# EAGLE schematic draftBoard (EAGLE 6.6.0)
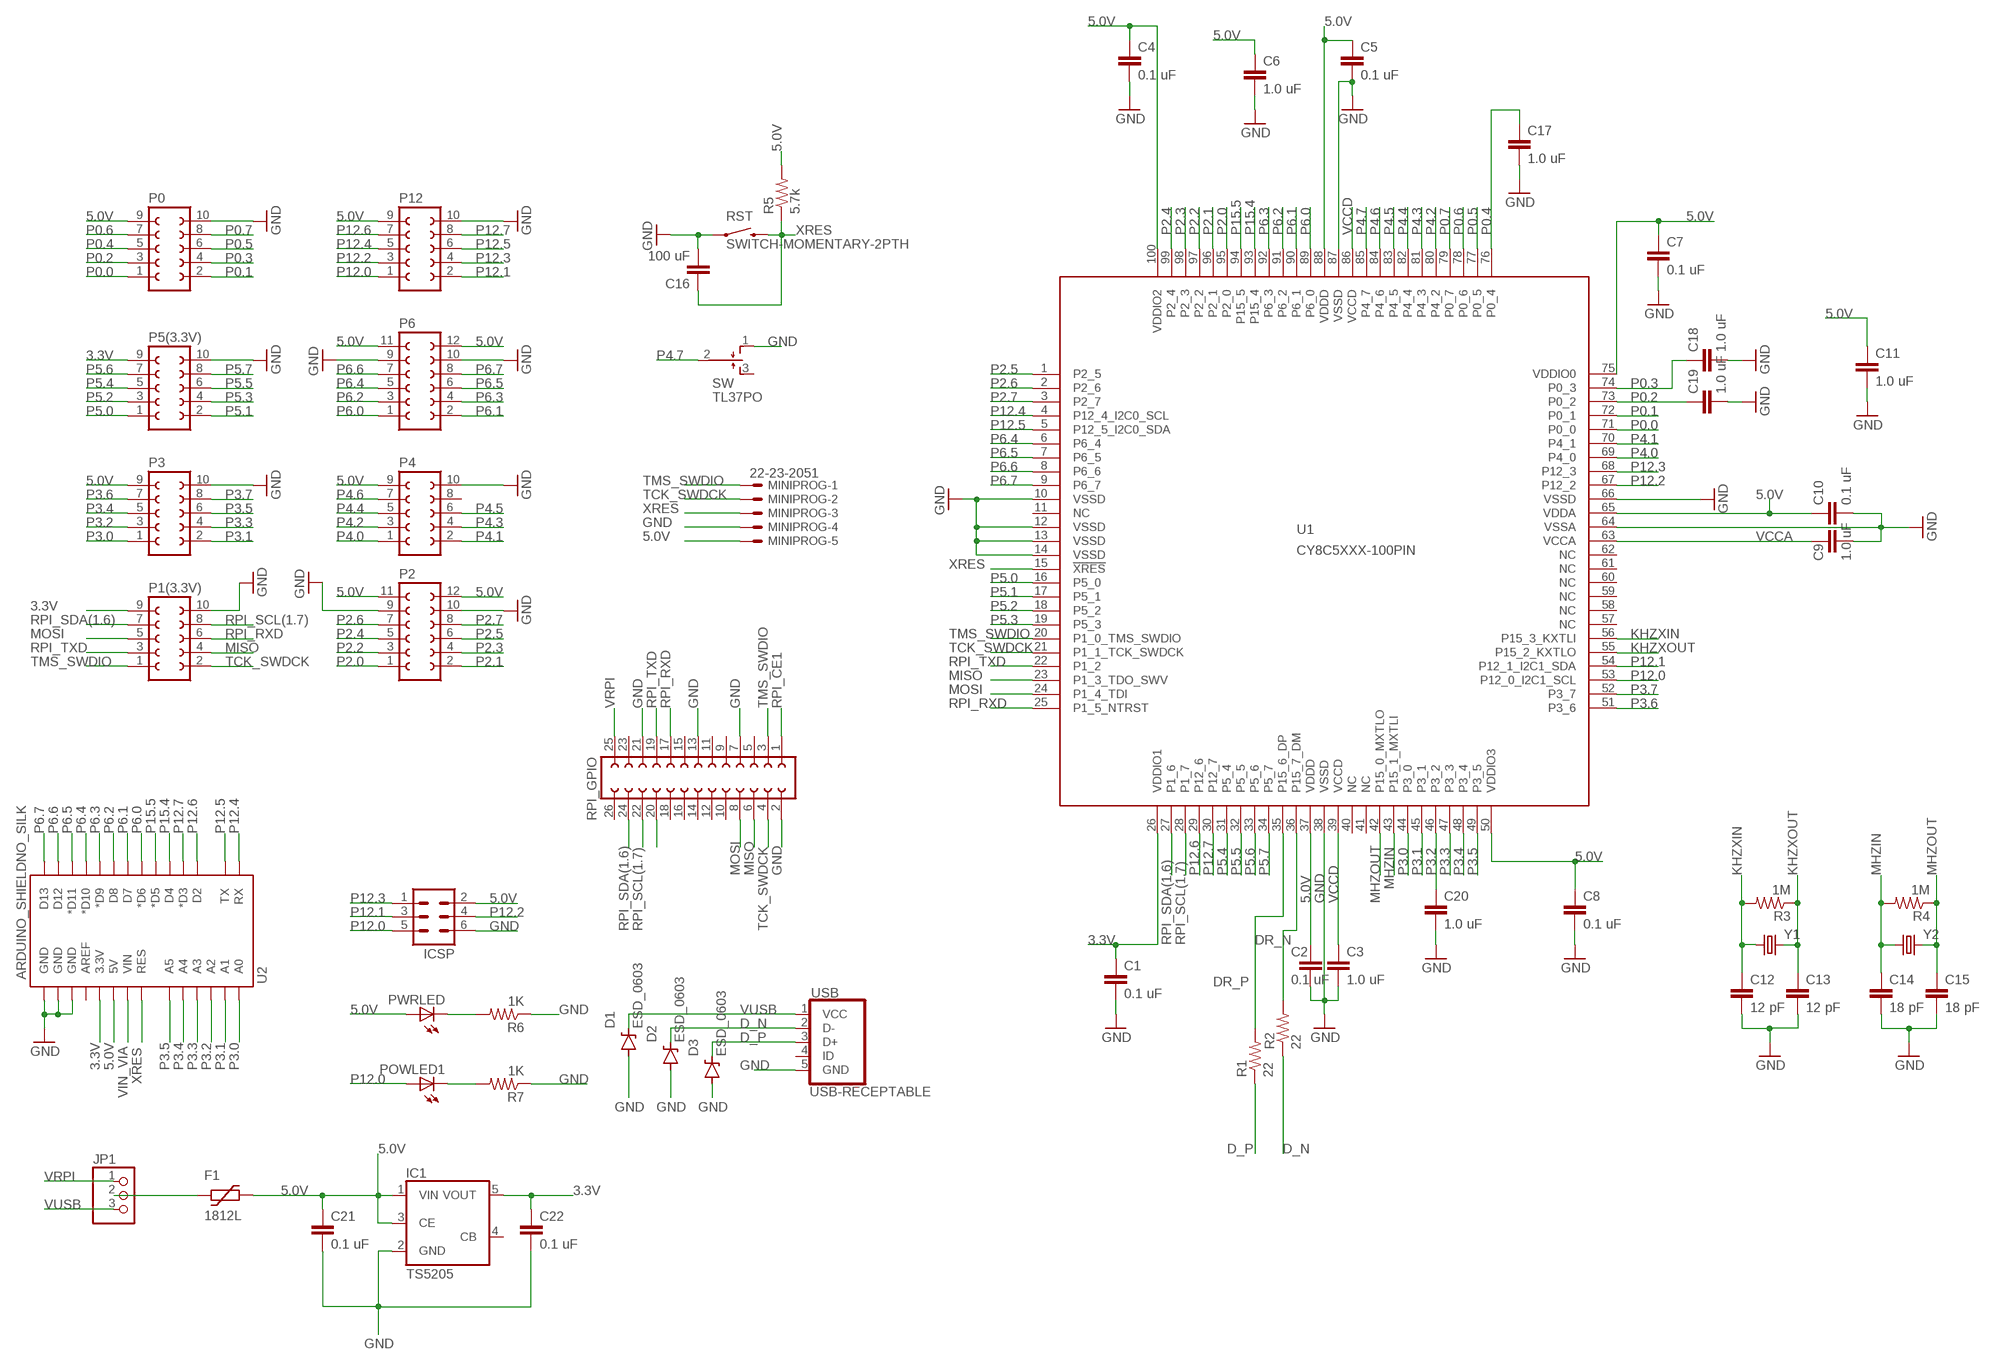
[diagram p0: schematic, sheet 1]

## Parts
C1  0.1 uF  CAP0603-CAP  [0603-CAP@1]
C2  0.1 uF  CAP0603-CAP  [0603-CAP@1]
C3  1.0 uF  CAP0603-CAP  [0603-CAP@1]
C4  0.1 uF  CAP0603-CAP  [0603-CAP@1]
C5  0.1 uF  CAP0603-CAP  [0603-CAP@1]
C6  1.0 uF  CAP0603-CAP  [0603-CAP@1]
C7  0.1 uF  CAP0603-CAP  [0603-CAP@1]
C8  0.1 uF  CAP0603-CAP  [0603-CAP@1]
C9  1.0 uF  CAP0603-CAP  [0603-CAP@1]
C10  0.1 uF  CAP0603-CAP  [0603-CAP@1]
C11  1.0 uF  CAP0603-CAP  [0603-CAP@1]
C12  12 pF  CAP0603-CAP  [0603-CAP@1]
C13  12 pF  CAP0603-CAP  [0603-CAP@1]
C14  18 pF  CAP0603-CAP  [0603-CAP@1]
C15  18 pF  CAP0603-CAP  [0603-CAP@1]
C16  100 uF  CAP0603-CAP  [0603-CAP@1]
C17  1.0 uF  CAP0603-CAP  [0603-CAP@1]
C18  1.0 uF  CAP0603-CAP  [0603-CAP@1]
C19  1.0 uF  CAP0603-CAP  [0603-CAP@1]
C20  1.0 uF  CAP0603-CAP  [0603-CAP@1]
C21  0.1 uF  CAP0603-CAP  [0603-CAP@1]
C22  0.1 uF  CAP0603-CAP  [0603-CAP@1]
D1  ESD_0603  [0603-CAP]
D2  ESD_0603  [0603-CAP]
D3  ESD_0603  [0603-CAP]
F1  1812L  [1812L]
IC1  TS5205  [SOT25]
ICSP  MA03-2  [MA03-2]
JP1  PINHD-1X3  [1X03]
MINIPROG  22-23-2051  [22-23-2051]
P0  FE05-2  [FE05-2]
P1(3.3V)  FE05-2  [FE05-2]
P2  FE06-2  [FE06-2]
P3  FE05-2  [FE05-2]
P4  FE05-2  [FE05-2]
P5(3.3V)  FE05-2  [FE05-2]
P6  FE06-2  [FE06-2]
P12  FE05-2  [FE05-2]
POWLED1  LED0603  [LED-0603]
PWRLED  LED0603  [LED-0603]
R1  22  RESISTOR0603-RES  [0603-RES]
R2  22  RESISTOR0603-RES  [0603-RES]
R3  1M  RESISTOR0603-RES  [0603-RES]
R4  1M  RESISTOR0603-RES  [0603-RES]
R5  5.7k  RESISTOR0603-RES  [0603-RES]
R6  1K  RESISTOR0603-RES  [0603-RES]
R7  1K  RESISTOR0603-RES  [0603-RES]
RPI_GPIO  FE13-2  [FE13-2]
RST  SWITCH-MOMENTARY-2PTH  [TACTILE-PTH]
SW  TL37PO  [TL3XPO]
U1  CY8C5XXX-100PIN  [TQFP-14X14-100]
U2  ARDUINO_SHIELDNO_SILK  [DUEMILANOVE_VIAS]
USB  USB-RECEPTABLE  [FCI-10103594-0001LF]
Y1  CRYSTALTC26H  [TC26H]
Y2  CRYSTALHC49US  [HC49US]

## Nets
3.3V: C1.1 C22.1 IC1.5(VOUT) P1(3.3V).9 P5(3.3V).9 U1.26(VDDIO1) U2.3.3V
5.0V: C2.1 C4.1 C5.1 C6.1 C7.1 C8.1 C10.1 C11.1 C21.1 F1.P$2 IC1.1(VIN) IC1.3(CE) ICSP.2 MINIPROG.5 P0.9 P2.11 P2.12 P3.9 P4.9 P6.11 P6.12 P12.9 PWRLED.A R5.2 U1.37(VDDD) U1.50(VDDIO3) U1.65(VDDA) U1.75(VDDIO0) U1.88(VDDD) U1.100(VDDIO2) U2.5V
D_N: D2.1(C) R2.1 USB.2(D-)
D_P: D3.1(C) R1.1 USB.3(D+)
DR_N: R2.2 U1.36(P15_7_DM)
DR_P: R1.2 U1.35(P15_6_DP)
GND: C1.2 C2.2 C3.2 C4.2 C5.2 C6.2 C7.2 C8.2 C9.2 C10.2 C11.2 C12.2 C13.2 C14.2 C15.2 C16.2 C17.2 C18.2 C19.2 C20.2 C21.2 C22.2 D1.2(A) D2.2(A) D3.2(A) IC1.2(GND) ICSP.6 MINIPROG.4 P0.10 P1(3.3V).10 P2.9 P2.10 P3.10 P4.10 P5(3.3V).10 P6.9 P6.10 P12.10 R6.1 R7.1 RPI_GPIO.2 RPI_GPIO.7 RPI_GPIO.13 RPI_GPIO.21 RST.1 SW.1(O) U1.10(VSSD) U1.12(VSSD) U1.13(VSSD) U1.14(VSSD) U1.38(VSSD) U1.64(VSSA) U1.66(VSSD) U1.87(VSSD) U2.GND@0(GND) U2.GND@1(GND) U2.GND@2(GND) USB.5(GND)
KHZXIN: C12.1 R3.2 U1.56(P15_3_KXTLI) Y1.1
KHZXOUT: C13.1 R3.1 U1.55(P15_2_KXTLO) Y1.2
MHZIN: C14.1 R4.2 U1.43(P15_1_MXTLI) Y2.1
MHZOUT: C15.1 R4.1 U1.42(P15_0_MXTLO) Y2.2
MISO: P1(3.3V).4 RPI_GPIO.6 U1.23(P1_3_TDO_SWV)
MOSI: P1(3.3V).5 RPI_GPIO.8 U1.24(P1_4_TDI)
N$2: PWRLED.C R6.2
N$3: F1.P$1 JP1.2
N$6: POWLED1.C R7.2
N$16: RPI_GPIO.20
P0.0: P0.1 U1.71(P0_0)
P0.1: P0.2 U1.72(P0_1)
P0.2: C19.1 P0.3 U1.73(P0_2)
P0.3: C18.1 P0.4 U1.74(P0_3)
P0.4: C17.1 P0.5 U1.76(P0_4)
P0.5: P0.6 U1.77(P0_5)
P0.6: P0.7 U1.78(P0_6)
P0.7: P0.8 U1.79(P0_7)
P2.0: P2.1 U1.95(P2_0)
P2.1: P2.2 U1.96(P2_1)
P2.2: P2.3 U1.97(P2_2)
P2.3: P2.4 U1.98(P2_3)
P2.4: P2.5 U1.99(P2_4)
P2.5: P2.6 U1.1(P2_5)
P2.6: P2.7 U1.2(P2_6)
P2.7: P2.8 U1.3(P2_7)
P3.0: P3.1 U1.44(P3_0) U2.A0
P3.1: P3.2 U1.45(P3_1) U2.A1
P3.2: C20.1 P3.3 U1.46(P3_2) U2.A2
P3.3: P3.4 U1.47(P3_3) U2.A3
P3.4: P3.5 U1.48(P3_4) U2.A4
P3.5: P3.6 U1.49(P3_5) U2.A5
P3.6: P3.7 U1.51(P3_6)
P3.7: P3.8 U1.52(P3_7)
P4.0: P4.1 U1.69(P4_0)
P4.1: P4.2 U1.70(P4_1)
P4.2: P4.3 U1.80(P4_2)
P4.3: P4.4 U1.81(P4_3)
P4.4: P4.5 U1.82(P4_4)
P4.5: P4.6 U1.83(P4_5)
P4.6: P4.7 U1.84(P4_6)
P4.7: SW.2(P) U1.85(P4_7)
P5.0: P5(3.3V).1 U1.16(P5_0)
P5.1: P5(3.3V).2 U1.17(P5_1)
P5.2: P5(3.3V).3 U1.18(P5_2)
P5.3: P5(3.3V).4 U1.19(P5_3)
P5.4: P5(3.3V).5 U1.31(P5_4)
P5.5: P5(3.3V).6 U1.32(P5_5)
P5.6: P5(3.3V).7 U1.33(P5_6)
P5.7: P5(3.3V).8 U1.34(P5_7)
P6.0: P6.1 U1.89(P6_0) U2.D6(*D6)
P6.1: P6.2 U1.90(P6_1) U2.D7
P6.2: P6.3 U1.91(P6_2) U2.D8
P6.3: P6.4 U1.92(P6_3) U2.D9(*D9)
P6.4: P6.5 U1.6(P6_4) U2.D10(*D10)
P6.5: P6.6 U1.7(P6_5) U2.D11(*D11)
P6.6: P6.7 U1.8(P6_6) U2.D12
P6.7: P6.8 U1.9(P6_7) U2.D13
P12.0: ICSP.5 P12.1 POWLED1.A U1.53(P12_0_I2C1_SCL)
P12.1: ICSP.3 P12.2 U1.54(P12_1_I2C1_SDA)
P12.2: ICSP.4 P12.3 U1.67(P12_2)
P12.3: ICSP.1 P12.4 U1.68(P12_3)
P12.4: P12.5 U1.4(P12_4_I2C0_SCL) U2.RX
P12.5: P12.6 U1.5(P12_5_I2C0_SDA) U2.TX
P12.6: P12.7 U1.29(P12_6) U2.D2
P12.7: P12.8 U1.30(P12_7) U2.D3(*D3)
P15.4: U1.93(P15_4) U2.D4
P15.5: U1.94(P15_5) U2.D5(*D5)
RPI_CE1: RPI_GPIO.1
RPI_RXD: P1(3.3V).6 RPI_GPIO.17 U1.25(P1_5_NTRST)
RPI_SCL(1.7): P1(3.3V).8 RPI_GPIO.22 U1.28(P1_7)
RPI_SDA(1.6): P1(3.3V).7 RPI_GPIO.24 U1.27(P1_6)
RPI_TXD: P1(3.3V).3 RPI_GPIO.19 U1.22(P1_2)
TCK_SWDCK: MINIPROG.2 P1(3.3V).2 RPI_GPIO.4 U1.21(P1_1_TCK_SWDCK)
TMS_SWDIO: MINIPROG.1 P1(3.3V).1 RPI_GPIO.3 U1.20(P1_0_TMS_SWDIO)
VCCA: C9.1 U1.63(VCCA)
VCCD: C3.1 U1.39(VCCD) U1.86(VCCD)
VIN_VIA: U2.VIN
VRPI: JP1.1 RPI_GPIO.25
VUSB: D1.1(C) JP1.3 USB.1(VCC)
XRES: C16.1 MINIPROG.3 R5.1 RST.3 U1.15(!XRES!) U2.RES
Unconnected: IC1.4(CB) P4.8 RPI_GPIO.5 RPI_GPIO.9 RPI_GPIO.10 RPI_GPIO.11 RPI_GPIO.12 RPI_GPIO.14 RPI_GPIO.15 RPI_GPIO.16 RPI_GPIO.18 RPI_GPIO.23 RPI_GPIO.26 SW.3(S) U1.11(NC) U1.40(NC) U1.41(NC) U1.57(NC) U1.58(NC) U1.59(NC) U1.60(NC) U1.61(NC) U1.62(NC) U2.AREF USB.4(ID)

## Library data of the parts
C1-C22 = SparkFun-Capacitors:CAP: Capacitor Standard 0603 ceramic capacitor, and 0.1" leaded capacitor.
D1-D3 = SparkFun-Capacitors:ESD_0603
F1 = ptc-littlefuse:1812L
IC1 = v-reg:TS5205: 150mA Low Noise LDO Voltage Regulator with Enable TSC [Taiwan Semiconductor Company, Ltd] Source: http://www.taiwansemi.com .. 5205_0409c.pdf
ICSP = con-lstb:MA03-2: PIN HEADER; OC_FARNELL: unknown; OC_NEWARK: unknown
JP1 = pinhead:PINHD-1X3: PIN HEADER
MINIPROG = con-molex:22-23-2051: .100" (2.54mm) Center Header - 5 Pin; MF: MOLEX; MPN: 22-23-2051; OC_FARNELL: 1462952; OC_NEWARK: 38C9178
P0 P1(3.3V) P3 P4 P5(3.3V) P12 = con-lsta:FE05-2: FEMALE HEADER; OC_FARNELL: unknown; OC_NEWARK: unknown
P2 P6 = con-lsta:FE06-2: FEMALE HEADER; OC_FARNELL: unknown; OC_NEWARK: unknown
POWLED1 PWRLED = SparkFun-LED:LED: LEDs Standard schematic elements and footprints for 5mm, 3mm, 1206, and 0603 sized LEDs. 5mm - Spark Fun Electronics SKU : COM-00529 (and others)
R1-R7 = SparkFun-Passives:RESISTOR: Resistor Basic schematic elements and footprints for 0603, 1206, and PTH resistors.
RPI_GPIO = con-lsta:FE13-2: FEMALE HEADER; OC_FARNELL: unknown; OC_NEWARK: unknown
RST = SparkFun-Electromechanical:SWITCH-MOMENTARY-2: Various NO switches- pushbuttons, reed, etc
SW = switch:TL37PO: TINY SWITCH MOM OFF MOM Source: http://www2.produktinfo.conrad.com/datenblaetter/700000-724999/705152-da-01-de-Subminiaturschalter_TL_36YO.pdf
U1 = cypress_psoc_V1_0:CY8C5XXX-100PIN: Cypress PSoC® 5 - Programmable System on Chip, ARM Cortex-M3 Based Source Data: http://www.cypress.com/?mpn=CY8C5588AXI-060 LBR Source: http://www.westmarkelectronics.com Thomas W. Moxon Director of Engineering www.westmarkelectronics.com; MPN: CY8C5588AXI-060
U2 = SparkFun-Boards:ARDUINO_SHIELD: Arduino shield footprint
USB = daspilker_2:USB-RECEPTABLE: USB Receptable
Y1 Y2 = SparkFun-FreqCtrl:CRYSTAL: Various standard crystals. Proven footprints. Spark Fun Electronics SKU : COM-00534